# Altium schematic sheet tof_sideXtal_timing2.SchDoc
size A4
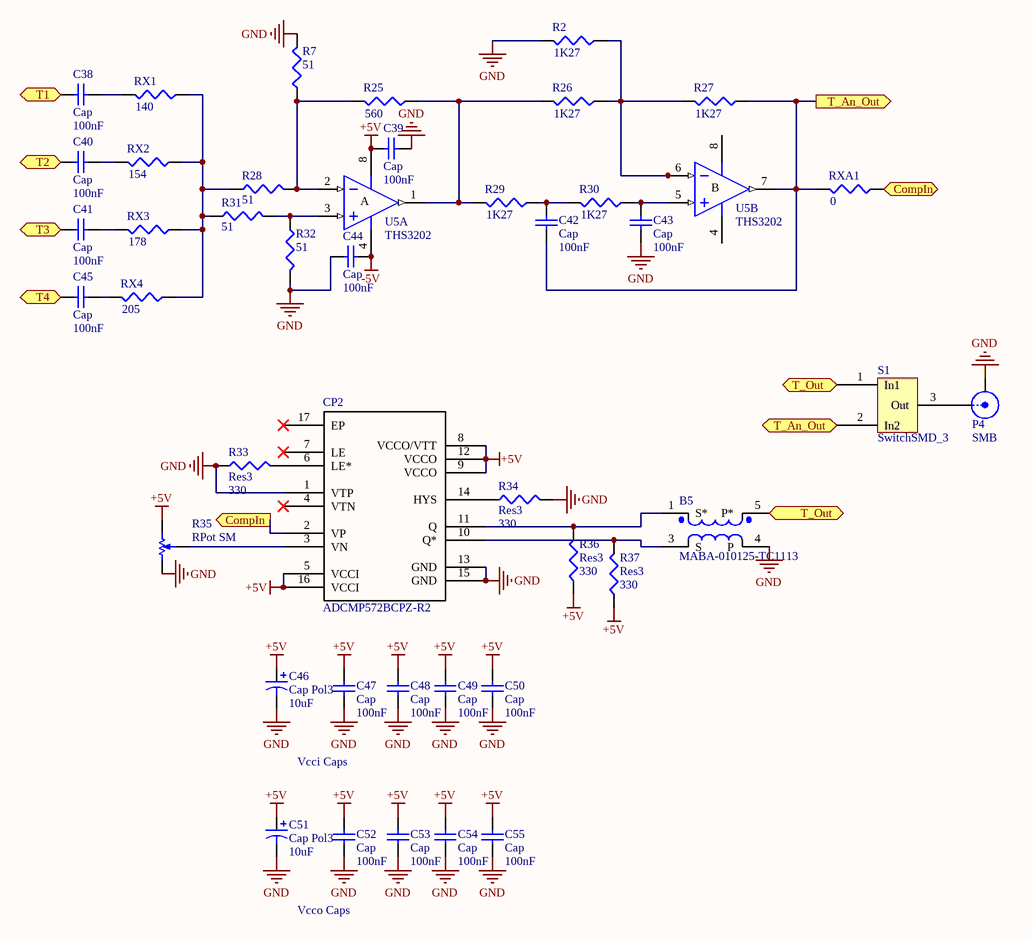
[diagram p0: tof_sideXtal_timing2.SchDoc]

## Parts
B5  MABA-010125-TC1113  [SM-22]
C38  Cap  value 100nF  [0402]
C39  Cap  value 100nF  [0402]
C40  Cap  value 100nF  [0402]
C41  Cap  value 100nF  [0402]
C42  Cap  value 100nF  [0402]
C43  Cap  value 100nF  [0402]
C44  Cap  value 100nF  [0402]
C45  Cap  value 100nF  [0402]
C46  Cap Pol3  value 10uF  [1608[0603]]
C47  Cap  value 100nF  [0402]
C48  Cap  value 100nF  [0402]
C49  Cap  value 100nF  [0402]
C50  Cap  value 100nF  [0402]
C51  Cap Pol3  value 10uF  [1608[0603]]
C52  Cap  value 100nF  [0402]
C53  Cap  value 100nF  [0402]
C54  Cap  value 100nF  [0402]
C55  Cap  value 100nF  [0402]
CP2  ADCMP572BCPZ-R2  [CP_16_3]
P4  SMB  [SMA-SMD]
R2  value 1K27  [0402]  (hidden comment: Res3)
R7  value 51  [0402]  (hidden comment: Res3)
R25  value 560  [0402]  (hidden comment: Res3)
R26  value 1K27  [0402]  (hidden comment: Res3)
R27  value 1K27  [0402]  (hidden comment: Res3)
R28  value 51  [0402]  (hidden comment: Res3)
R29  value 1K27  [0402]  (hidden comment: Res3)
R30  value 1K27  [0402]  (hidden comment: Res3)
R31  value 51  [0402]  (hidden comment: Res3)
R32  value 51  [0402]  (hidden comment: Res3)
R33  Res3  value 330  [0402]
R34  Res3  value 330  [0402]
R35  RPot SM  [POT-3MM-SMD]
R36  Res3  value 330  [0402]
R37  Res3  value 330  [0402]
RX1  value 140  [0402]  (hidden comment: Res3)
RX2  value 154  [0402]  (hidden comment: Res3)
RX3  value 178  [0402]  (hidden comment: Res3)
RX4  value 205  [0402]  (hidden comment: Res3)
RXA1  value 0  [0402]  (hidden comment: Res3)
S1  SwitchSMD_3  [SwitchSMD_0603]
U5  THS3202  [SO-8_N]  (parts A,B of 2)

## Ports
CompIn (out), T1 (out), T2 (out), T3 (out), T4 (out), T_An_Out (out), T_Out (out)

## Nets
+5V: C39.1 C46.1 C47.2 C48.2 C49.2 C50.2 C51.1 C52.2 C53.2 C54.2 C55.2 CP2.5(VCCI) CP2.8(VCCO/VTT) CP2.9(VCCO) CP2.12(VCCO) CP2.16(VCCI) R35.CW(+) R36.1 R37.1 U5.8(V+)
-5V: C44.2 U5.4(V-)
GND: B5.4(P) C39.2 C43.2 C44.1 C46.2 C47.1 C48.1 C49.1 C50.1 C51.2 C52.1 C53.1 C54.1 C55.1 CP2.1(VTP) CP2.13(GND) CP2.15(GND) P4.2(Y) R2.2 R7.2 R32.2 R33.1 R34.2 R35.CCW(-)
CompIn: CP2.2(VP) RXA1.1 ; port CompIn
T1: C38.1 ; port T1
T2: C40.1 ; port T2
T3: C41.1 ; port T3
T4: C45.1 ; port T4
T_An_Out: C42.2 R27.1 RXA1.2 S1.2(In2) U5.7(OUT) ; port T_An_Out
T_Out: B5.5(P*) S1.1(In1) ; port T_Out
NetB5_1: B5.1(S*) CP2.11(Q) R36.2
NetB5_3: B5.3(S) CP2.10(Q*) R37.2
NetC38_2: C38.2 RX1.2
NetC40_2: C40.2 RX2.2
NetC41_2: C41.2 RX3.2
NetC42_1: C42.1 R29.1 R30.2
NetC43_1: C43.1 R30.1 U5.5(IN+)
NetC45_2: C45.2 RX4.2
NetCP2_3: CP2.3(VN) R35.W
NetCP2_6: CP2.6(LE*) R33.2
NetCP2_14: CP2.14(HYS) R34.1
NetP4_1: P4.1(X) S1.3(Out)
NetR2_1: R2.1 R26.1 R27.2 U5.6(IN-)
NetR7_1: R7.1 R25.2 R28.2 U5.2(IN-)
NetR25_1: R25.1 R26.2 R29.2 U5.1(OUT)
NetR28_1: R28.1 R31.1 RX1.1 RX2.1 RX3.1 RX4.1
NetR31_2: R31.2 R32.1 U5.3(IN+)

Not connected (* = marked no-connect by the designer): CP2 4(VTN)* 7(LE)* 17(EP)*

## Notes on the sheet
- Vcci Caps
- Vcco Caps
- (in symbol AD8002AR, part A) A
- (in symbol AD8002AR, part B) B

## Library data of the parts
C38-C45 C47-C50 C52-C55 = Cap: Capacitor; Published: 8-Jun-2000; LatestRevisionDate: 17-Jul-2002; LatestRevisionNote: Re-released for DXP Platform.; PackageReference: RAD-0.3; Publisher: Altium Limited; PackageDescription: Radial Cap, Thru-Hole; 2 Leads; 0.3 in Pin Spacing
C46 C51 = Cap Pol3: Polarized Capacitor (Surface Mount); Published: 8-Jun-2000; LatestRevisionDate: 29-May-2009; LatestRevisionNote: IPC-7351 Footprint Added.; PackageReference: C0805; Publisher: Altium Limited; PackageDescription: Chip Capacitor
CP2 = ADCMP572BCPZ-R2: Imported; Manufacturer_Part_Number: ADCMP572BCPZ-R2; Vendor: Vendor; RefDes: RefDes; Type: DEV; Value: Value
P4 = SMB: SMB Straight Connector; LatestRevisionDate: 17-Jul-2002; LatestRevisionNote: Re-released for DXP Platform.; Publisher: Altium Limited
R2 R7 R25-R34 R36 R37 RX1-RX4 RXA1 = Res3: Resistor; Published: 8-Jun-2000; LatestRevisionDate: 29-May-2009; LatestRevisionNote: IPC-7351 Footprint Added.; PackageReference: J1-0603; Publisher: Altium Limited; PackageDescription: Chip Resistor
R35 = RPot SM: Square Trimming Potentiometer; Published: 17-Dec-2003; DatasheetVersion: Oct-2003; PackageReference: POT4MM-2; Publisher: Altium Limited; PackageDescription: Square Trimming Potentiometer; ComponentLink1Description: Manufacturer Link; ComponentLink1URL: http://bourns.com/2/search.html
U5 = AD8002AR: Dual 600MHz, 50mW Current Feedback Amplifier; Published: 8-Jun-2000; LatestRevisionDate: 13-Apr-2006; LatestRevisionNote: IPC-7351 Footprint Added.; DatasheetVersion: REV. C 1999; PackageVersion: revA; PackageReference: SO-8; Publisher: Altium Limited; PackageDescription: 8-Pin Small Outline Integrated Circuit 1.27 mm Pitch; Code_JEDEC: MS-012-AA; Code_IPC: SOIC127P600-8; ComponentLink1Description: Manufacturer Link; ComponentLink1URL: http://www.analog.com/en/prod/0,,759_786_AD8002%2C00.html; ComponentLink2Description: Datasheet; ComponentLink2URL: http://www.analog.com/UploadedFiles/Data_Sheets/147523773AD8002_d.pdf